# Altium schematic sheet keycontrol1.SchDoc
size A3
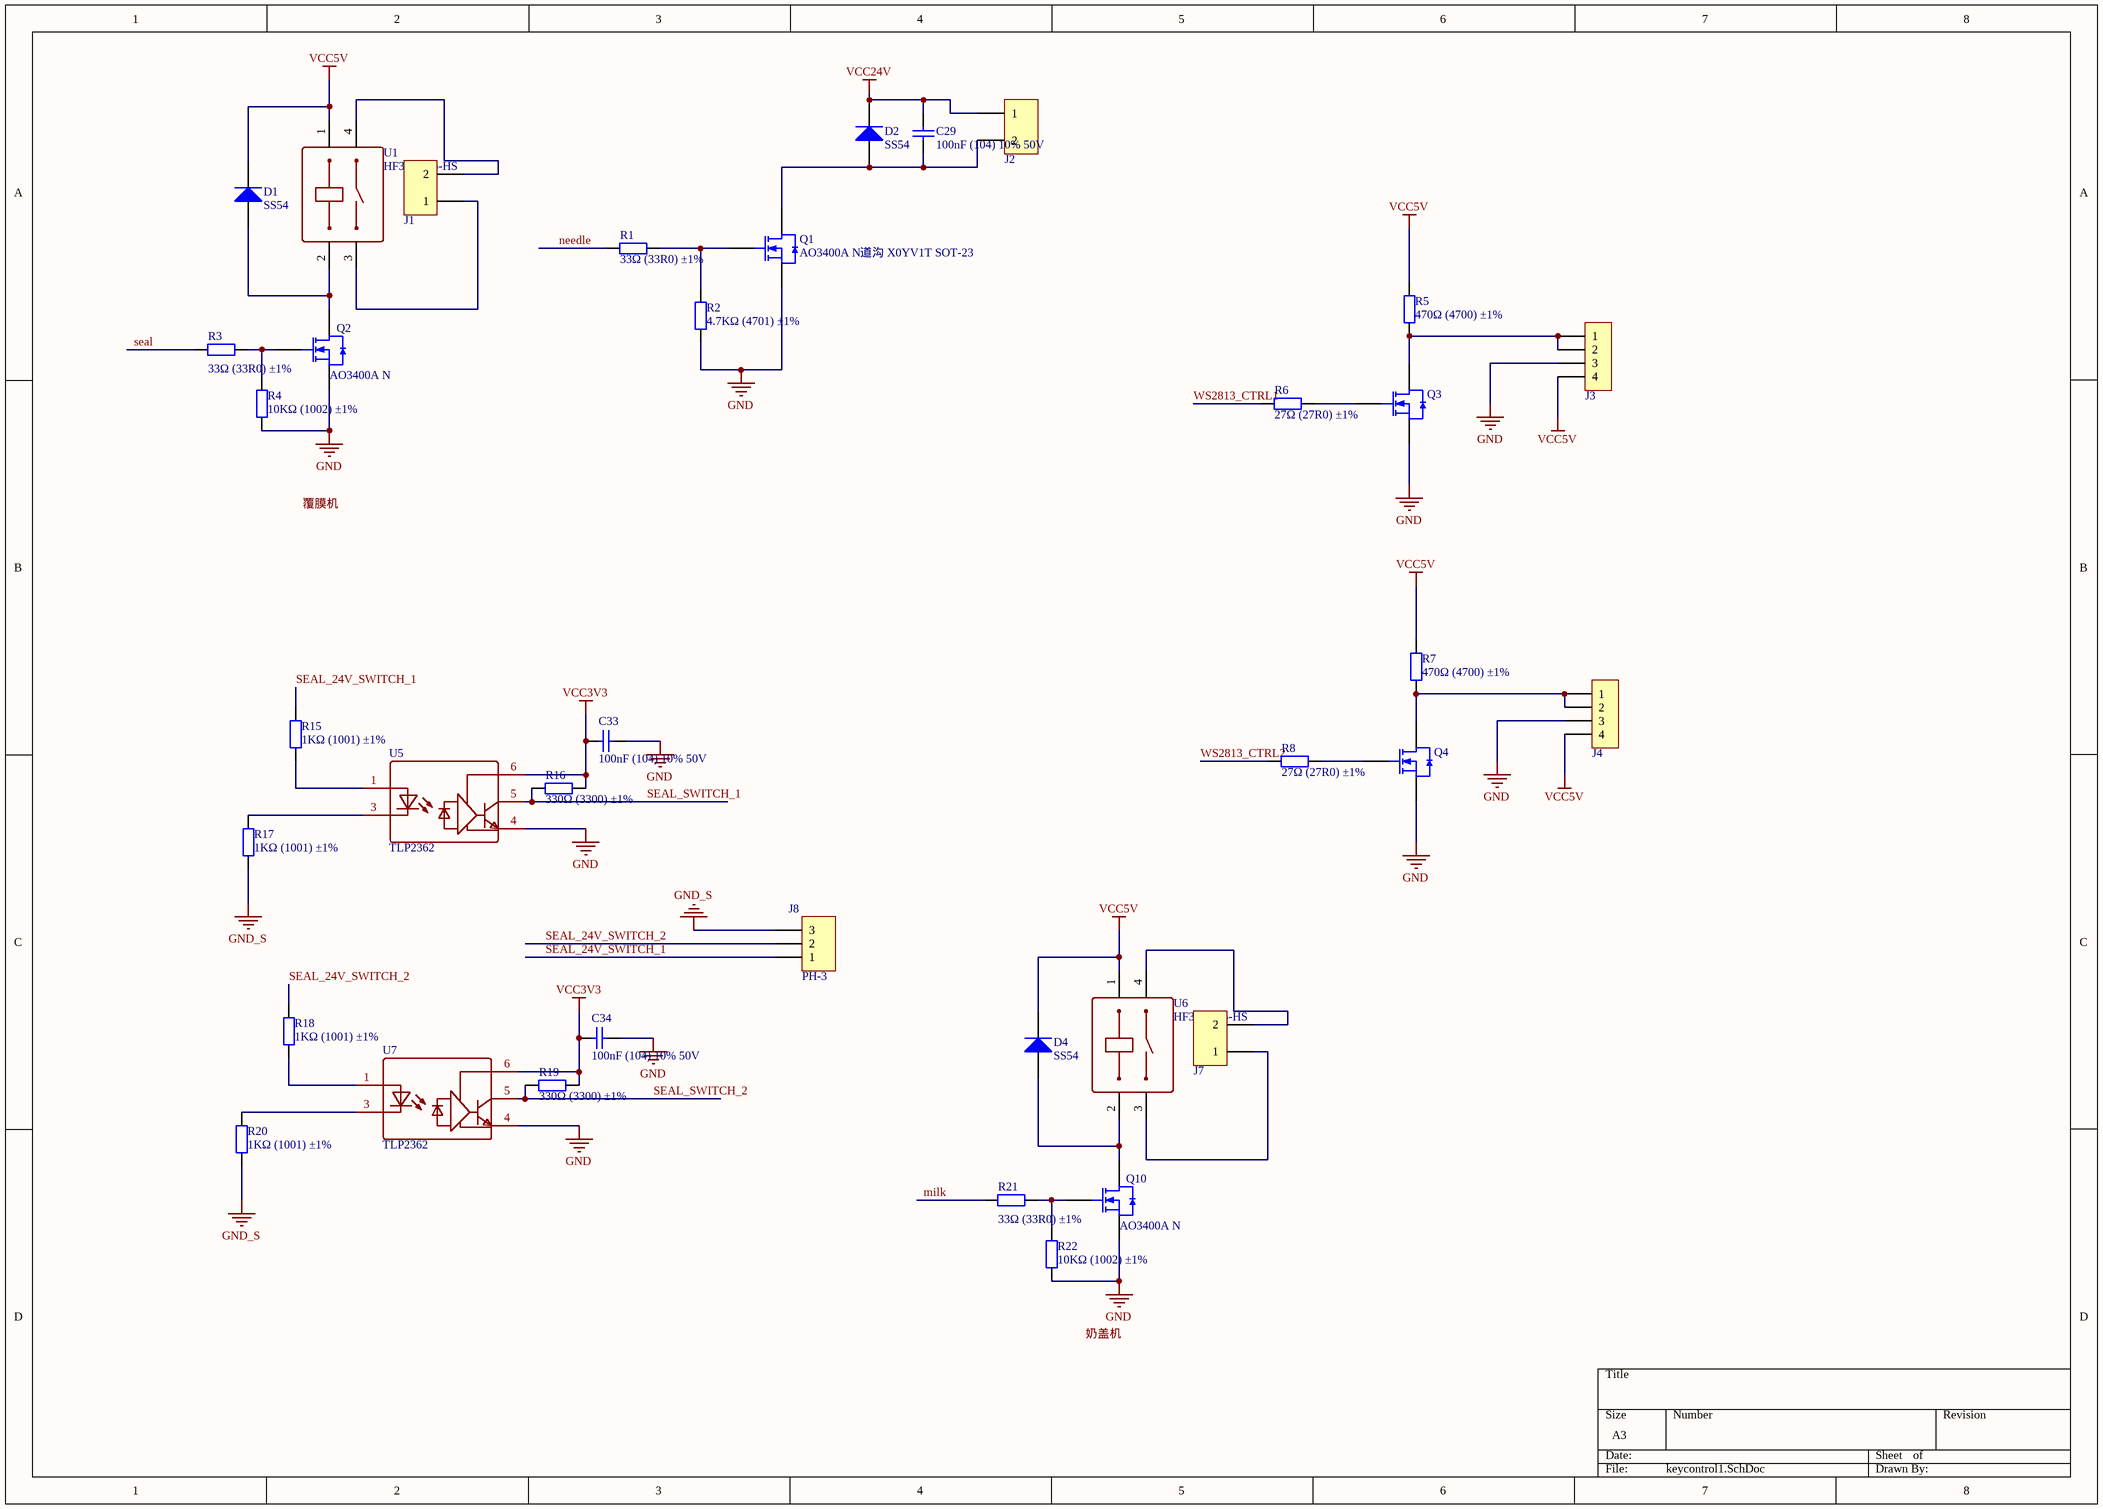
[diagram p0: keycontrol1.SchDoc]

## Parts
C29  100nF (104) 10% 50V  [0603_C]
C33  100nF (104) 10% 50V  [0603_C]
C34  100nF (104) 10% 50V  [0603_C]
D1  SS54  [SMA(DO-214AC)_S1]
D2  SS54  [SMA(DO-214AC)_S1]
D4  SS54  [SMA(DO-214AC)_S1]
J1  MOTOR  [PH2-2.0]  (value not drawn)
J2  MOTOR  [XH-2P]  (value not drawn)
J3  header4  [xh-4]  (value not drawn)
J4  header4  [xh-4]  (value not drawn)
J7  MOTOR  [PH2-2.0]  (value not drawn)
J8  PH-3  [ph3-2.0]
Q1  AO3400A N道沟 X0YV1T SOT-23  [SOT-23-3L]
Q2  AO3400A N  [SOT-23-3L]
Q3  AO3400A N道沟 X0YV1T SOT-23  [SOT-23-3L]  (value not drawn)
Q4  AO3400A N道沟 X0YV1T SOT-23  [SOT-23-3L]  (value not drawn)
Q10  AO3400A N  [SOT-23-3L]
R1  33Ω (33R0) ±1%  [0603_R]
R2  4.7KΩ (4701) ±1%  [0603_R]
R3  33Ω (33R0) ±1%  [0603_R]
R4  10KΩ (1002) ±1%  [0603_R]
R5  470Ω (4700) ±1%  [0603_R]
R6  27Ω (27R0) ±1%  [0603_R]
R7  470Ω (4700) ±1%  [0603_R]
R8  27Ω (27R0) ±1%  [0603_R]
R15  1KΩ (1001) ±1%  [1206_R]
R16  330Ω (3300) ±1%  [0603_R]
R17  1KΩ (1001) ±1%  [1206_R]
R18  1KΩ (1001) ±1%  [1206_R]
R19  330Ω (3300) ±1%  [0603_R]
R20  1KΩ (1001) ±1%  [1206_R]
R21  33Ω (33R0) ±1%  [0603_R]
R22  10KΩ (1002) ±1%  [0603_R]
U1  HF32F/005-HS  [HF32F/005-HS]
U5  TLP2362  [SO-5]
U6  HF32F/005-HS  [HF32F/005-HS]
U7  TLP2362  [SO-5]

## Nets
GND: C33.2 C34.2 J3.3 J4.3 Q1.2(S) Q2.2(S) Q3.2(S) Q4.2(S) Q10.2(S) R2.1 R4.1 R22.1 U5.4 U7.4
GND_S: J8.3 R17.1 R20.1
VCC3V3: C33.1 C34.1 R16.2 R19.2 U5.6 U7.6
VCC5V: D1.2(K) D4.2(K) J3.4 J4.4 R5.2 R7.2 U1.1 U6.1
VCC24V: C29.2 D2.2(K) J2.1
milk: R21.1
needle: R1.1
seal: R3.1
SEAL_24V_SWITCH_1: J8.1 R15.2
SEAL_24V_SWITCH_2: J8.2 R18.2
SEAL_SWITCH_1: R16.1 U5.5
SEAL_SWITCH_2: R19.1 U7.5
WS2813_CTRL1: R6.1
WS2813_CTRL2: R8.1
NetC29_1: C29.1 D2.1(A) J2.2 Q1.3(D)
NetD1_1: D1.1(A) Q2.3(D) U1.2
NetD4_1: D4.1(A) Q10.3(D) U6.2
NetJ1_1: J1.1 U1.3
NetJ1_2: J1.2 U1.4
NetJ3_1: J3.1 J3.2 Q3.3(D) R5.1
NetJ4_1: J4.1 J4.2 Q4.3(D) R7.1
NetJ7_1: J7.1 U6.3
NetJ7_2: J7.2 U6.4
NetQ1_1: Q1.1(G) R1.2 R2.2
NetQ2_1: Q2.1(G) R3.2 R4.2
NetQ3_1: Q3.1(G) R6.2
NetQ4_1: Q4.1(G) R8.2
NetQ10_1: Q10.1(G) R21.2 R22.2
NetR15_1: R15.1 U5.1
NetR17_2: R17.2 U5.3
NetR18_1: R18.1 U7.1
NetR20_2: R20.2 U7.3

## Notes on the sheet
- Labels drawn without touching a wire or pin: 奶盖机, 覆膜机

## Library data of the parts
C29 C33 C34 = 0603 100nF (104) 10% 50V: 贴片电容; ComponentLink1Description: 供应商链接; ComponentLink1URL: http://www.szlcsc.com/product/details_15331.html; Package: 0603; Supplier: LC; SuppliersPartNumber: C14663
D1 D2 D4 = SMA(DO-214AC) SS54: 二极管; ComponentLink1Description: 供应商链接; ComponentLink1URL: http://www.szlcsc.com/product/details_23178.html; Package: SMA(DO-214AC); Supplier: LC; SuppliersPartNumber: C22452
J1 J2 J7 = header2
J8 = XH-3
Q1-Q4 Q10 = AO3400A N道沟 X0YV1T SOT-23: MOS(场效应管); ComponentLink1Description: 供应商链接; ComponentLink1URL: http://www.szlcsc.com/product/details_21629.html; Package: SOT-23; Supplier: LC; SuppliersPartNumber: C20917
R1 R3 R21 = 0603 33Ω (33R0) 1%: 贴片电阻; ComponentLink1Description: 供应商链接; ComponentLink1URL: http://www.szlcsc.com/product/details_23867.html; Package: 0603; Supplier: LC; SuppliersPartNumber: C23140
R2 = 0603 4.7KΩ (4701) 1%: 贴片电阻; ComponentLink1Description: 供应商链接; ComponentLink1URL: http://www.szlcsc.com/product/details_23889.html; Package: 0603; Supplier: LC; SuppliersPartNumber: C23162
R4 R22 = 0603 10KΩ (1002) 1%: 贴片电阻; ComponentLink1Description: 供应商链接; ComponentLink1URL: http://www.szlcsc.com/product/details_26547.html; Package: 0603; Supplier: LC; SuppliersPartNumber: C25804
R5 R7 = 0603 470Ω (4700) 1%: 贴片电阻; ComponentLink1Description: 供应商链接; ComponentLink1URL: http://www.szlcsc.com/product/details_23906.html; Package: 0603; Supplier: LC; SuppliersPartNumber: C23179
R6 R8 = 0603 27Ω (27R0) 1%: 贴片电阻; ComponentLink1Description: 供应商链接; ComponentLink1URL: http://www.szlcsc.com/product/details_25933.html; Package: 0603; Supplier: LC; SuppliersPartNumber: C25190
R15 R17 R18 R20 = 1206 1KΩ (1001) 1%: 贴片电阻; ComponentLink1Description: 供应商链接; ComponentLink1URL: http://www.szlcsc.com/product/details_4817.html; Package: 1206; Supplier: LC; SuppliersPartNumber: C4410
R16 R19 = 0603 330Ω (3300) 1%: 贴片电阻; ComponentLink1Description: 供应商链接; ComponentLink1URL: http://www.szlcsc.com/product/details_23865.html; Package: 0603; Supplier: LC; SuppliersPartNumber: C23138
U1 U6 = HF32F/005-HS: 继电器